# EAGLE design NewBoard (EAGLE 9.6.2)
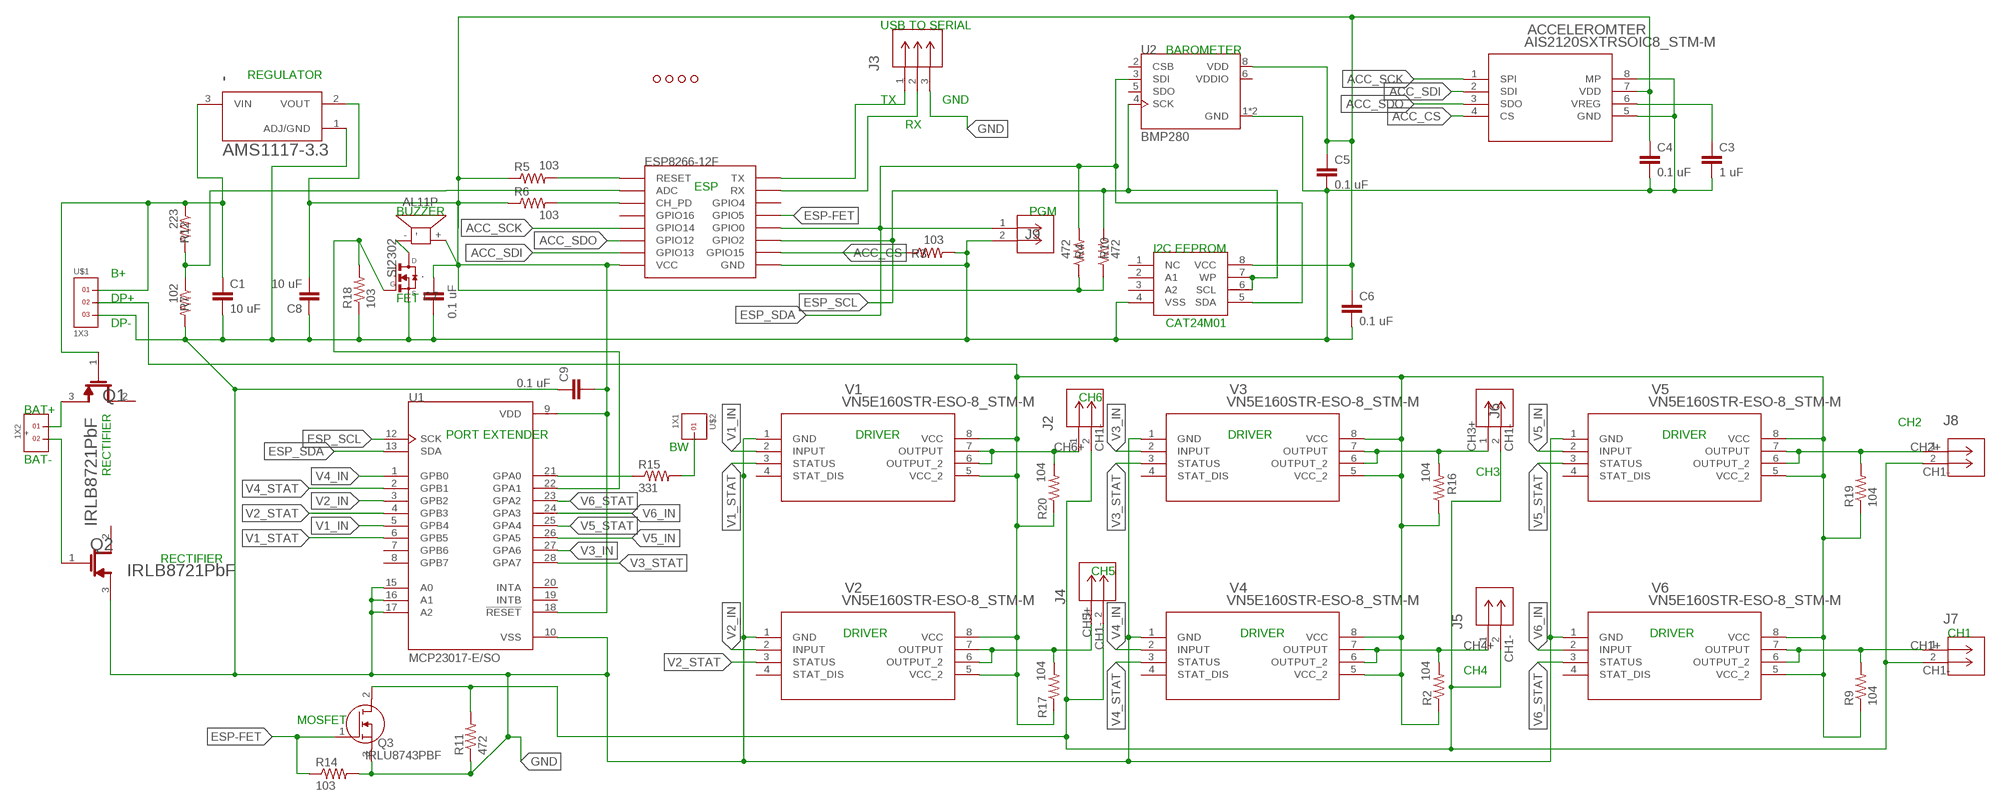
[diagram p0: schematic, sheet 1]

## Parts
'  AMS1117-3.3  [SOT229P700X180-4N]
+  1X2  [1X2]
,  AL11P  [AL11P]
.  SI2302  [SOT23]
ACCELEROMTER  AIS2120SXTRSOIC8_STM-M  [SOIC8_STM-M]
C1  10 uF  C-EUC1206  [C1206]
C3  1 uF  C-EUC1206  [C1206]
C4  0.1 uF  C-EUC1206  [C1206]
C5  0.1 uF  C-EUC1206  [C1206]
C6  0.1 uF  C-EUC1206  [C1206]
C7  0.1 uF  C-EUC1206  [C1206]
C8  10 uF  C-EUC1206  [C1206]
C9  0.1 uF  C-EUC1206  [C1206]
CAT24M01A_EEPROM  CAT24M01WI-GT3  [SO08]
ESP8266-12F  ESP12SMD  [ESP12-SMD]
J2  61300211121  [CONN_61300211121_WRE]
J3  68000-103HLF  [CONN_68000-103HLF_AMP]
J4  61300211121  [CONN_61300211121_WRE]
J5  61300211121  [CONN_61300211121_WRE]
J6  61300211121  [CONN_61300211121_WRE]
J7  61300211121  [CONN_61300211121_WRE]
J8  61300211121  [CONN_61300211121_WRE]
J9  61300211121  [CONN_61300211121_WRE]
Q1  INFINEON_IRLB8721PBFINFINEON_IRLB8721PBF_0_0  [INFINEON_IRLB8721PBF_0]
Q2  INFINEON_IRLB8721PBFINFINEON_IRLB8721PBF_0_0  [INFINEON_IRLB8721PBF_0]
Q3  IRLU8743PBF  [TO229P239X654X978-3P]
R2  104  R-US_R2010  [R2010]
R3  103  R-US_R2010  [R2010]
R4  472  R-US_R2010  [R2010]
R5  103  R-US_R2010  [R2010]
R6  103  R-US_R2010  [R2010]
R7  102  R-US_R2010  [R2010]
R9  104  R-US_R2010  [R2010]
R10  472  R-US_R2010  [R2010]
R11  472  R-US_R2010  [R2010]
R12  223  R-US_R2010  [R2010]
R14  103  R-US_R2010  [R2010]
R15  331  R-US_R2010  [R2010]
R16  104  R-US_R2010  [R2010]
R17  104  R-US_R2010  [R2010]
R18  103  R-US_R2010  [R2010]
R19  104  R-US_R2010  [R2010]
R20  104  R-US_R2010  [R2010]
U1  MCP23017-E/SO  [SOIC127P1030X265-28N]
U2  BMP280  [XDCR_BMP280]
U$1  1X3  [1X3]
U$2  1X1  [1X1]
U$3  HOLE.4MM  [#4]
U$4  HOLE.4MM  [#4]
U$5  HOLE.4MM  [#4]
U$6  HOLE.4MM  [#4]
V1  VN5E160STR-ESO-8_STM-M  [SO-8_STM-M]
V2  VN5E160STR-ESO-8_STM-M  [SO-8_STM-M]
V3  VN5E160STR-ESO-8_STM-M  [SO-8_STM-M]
V4  VN5E160STR-ESO-8_STM-M  [SO-8_STM-M]
V5  VN5E160STR-ESO-8_STM-M  [SO-8_STM-M]
V6  VN5E160STR-ESO-8_STM-M  [SO-8_STM-M]

## Nets
ACC_CS: ACCELEROMTER.4(CS) ESP8266-12F.GPIO15 R3.1
ACC_SCK: ACCELEROMTER.1(SPI) ESP8266-12F.GPIO14
ACC_SDI: ACCELEROMTER.2(SDI) ESP8266-12F.GPIO13
ACC_SDO: ACCELEROMTER.3(SDO) ESP8266-12F.GPIO12
B+: '.3(VIN) C1.1 Q1.1(G) R12.1 U$1.1
CH1+: J7.1 R9.2 V6.6(OUTPUT_2) V6.7(OUTPUT)
CH1-: J2.2 J4.2 J5.2 J6.2 J7.2 J8.2 Q3.2(D) R11.2
CH2+: J8.1 R19.2 V5.6(OUTPUT_2) V5.7(OUTPUT)
CH3+: J6.1 R16.2 V3.6(OUTPUT_2) V3.7(OUTPUT)
CH4+: J5.1 R2.2 V4.6(OUTPUT_2) V4.7(OUTPUT)
CH5+: J4.1 R17.2 V2.6(OUTPUT_2) V2.7(OUTPUT)
CH6+: J2.1 R20.2 V1.6(OUTPUT_2) V1.7(OUTPUT)
DP+: R2.1 R9.1 R16.1 R17.1 R19.1 R20.1 U$1.2 V1.5(VCC_2) V1.8(VCC) V2.5(VCC_2) V2.8(VCC) V3.5(VCC_2) V3.8(VCC) V4.5(VCC_2) V4.8(VCC) V5.5(VCC_2) V5.8(VCC) V6.5(VCC_2) V6.8(VCC)
ESP-FET: ESP8266-12F.GPIO5 Q3.1(G) R14.1
ESP_SCL: CAT24M01A_EEPROM.6(SCL) CAT24M01A_EEPROM.7(WP) ESP8266-12F.GPIO2 R10.2 U1.12(SCK) U2.4(SCK)
ESP_SDA: CAT24M01A_EEPROM.5(SDA) ESP8266-12F.GPIO0 J9.1 R4.2 U1.13(SDA) U2.3(SDI)
GND: '.1(ADJ/GND) ..2(S) ACCELEROMTER.5(GND) ACCELEROMTER.8(MP) C1.2 C3.2 C4.2 C5.2 C6.2 C7.1 C8.1 C9.1 CAT24M01A_EEPROM.4(VSS) ESP8266-12F.GND J3.3 J9.2 Q2.3(S) Q3.3(S) R3.2 R7.2 R11.1 R14.2 R18.1 U1.10(VSS) U1.15(A0) U1.16(A1) U1.17(A2) U2.1(GND) U2.7(GND) U$1.3 V1.1(GND) V2.1(GND) V3.1(GND) V4.1(GND) V5.1(GND) V6.1(GND)
N$1: ESP8266-12F.CH_PD R6.2
N$2: ESP8266-12F.RESET R5.2
N$3: +.2 Q2.1(G)
N$4: ACCELEROMTER.6(VREG) C3.1
N$5: ESP8266-12F.TXD0(TX) J3.1
N$6: ESP8266-12F.RXD0(RX) J3.2
N$7: ,.- ..3(D)
N$8: +.1 Q1.3(S)
N$9: '.2(VOUT) ,.+ ACCELEROMTER.7(VDD) C4.1 C5.1 C6.1 C7.2 C8.2 C9.2 CAT24M01A_EEPROM.8(VCC) ESP8266-12F.VCC R4.1 R5.1 R6.1 R10.1 U1.9(VDD) U1.18(!RESET) U2.8(VDD)
N$10: R15.2 U$2.1
N$16: ESP8266-12F.ADC R7.1 R12.2
N$21: R15.1 U1.21(GPA0)
N$25: ..1(G) R18.2 U1.22(GPA1)
V1_IN: U1.5(GPB4) V1.2(INPUT)
V1_STAT: U1.6(GPB5) V1.3(STATUS)
V2_IN: U1.3(GPB2) V2.2(INPUT)
V2_STAT: U1.4(GPB3) V2.3(STATUS)
V3_IN: U1.27(GPA6) V3.2(INPUT)
V3_STAT: U1.28(GPA7) V3.3(STATUS)
V4_IN: U1.1(GPB0) V4.2(INPUT)
V4_STAT: U1.2(GPB1) V4.3(STATUS)
V5_IN: U1.26(GPA5) V5.2(INPUT)
V5_STAT: U1.25(GPA4) V5.3(STATUS)
V6_IN: U1.24(GPA3) V6.2(INPUT)
V6_STAT: U1.23(GPA2) V6.3(STATUS)
Unconnected: CAT24M01A_EEPROM.1(NC) CAT24M01A_EEPROM.2(A1) CAT24M01A_EEPROM.3(A2) ESP8266-12F.GPIO4 ESP8266-12F.GPIO16 Q1.2(D) Q2.2(D) U1.7(GPB6) U1.8(GPB7) U1.19(INTB) U1.20(INTA) U2.2(CSB) U2.5(SDO) V1.4(STAT_DIS) V2.4(STAT_DIS) V3.4(STAT_DIS) V4.4(STAT_DIS) V5.4(STAT_DIS) V6.4(STAT_DIS)

## Notes on the sheet
- USB TO SERIAL
- BAROMETER
- REGULATOR
- TX | GND
- RX
- ESP
- BUZZER | PGM
- I2C EEPROM
- B+
- DP+ | FET
- DP- | CAT24M01
- CH6
- BAT+
- CH2
- PORT EXTENDER | DRIVER | DRIVER | DRIVER
- BW
- BAT-
- RECTIFIER | CH3
- RECTIFIER
- CH5
- DRIVER | DRIVER | DRIVER | CH1
- CH4
- MOSFET

## Power pins joined to a net without a drawn wire
VDDIO: U2.6(VDDIO)

## Library data of the parts
' = AMS1117-3.3:AMS1117-3.3: Sot223/Pkg 1-Amp 3.3-Volt Low Drop Out Voltage Regulatator Check availability <https://pricing.snapeda.com/parts/AMS1117-3.3/Advanced%20Monolithic%20Systems/view-part?ref=eda>; AVAILABILITY: Not in stock; DESCRIPTION: LDO Voltage Regulators 800MA LDO LINEAR REG; MF: Advanced Monolithic Systems; MP: AMS1117-3.3; PACKAGE: SOT-223 Seeed Technology; PRICE: None
+ = headers(2mm):1X2
, = buzzer:AL11P: SPEAKER Source: Buerklin; OC_FARNELL: unknown; OC_NEWARK: unknown
. = SI2302 FET:SI2302: MOSFET N-Channel 20 V (D-S) Check availability <https://pricing.snapeda.com/parts/SI2302/Vishay%20Siliconix/view-part?ref=eda>; AVAILABILITY: Not in stock; DESCRIPTION: N-Channel 20 V 2.6A (Ta) 710mW (Ta) Surface Mount SOT-23-3 (TO-236); MF: Vishay Siliconix; MP: SI2302; PACKAGE: SOT-23-3 Vishay Siliconix; PRICE: None
ACCELEROMTER = AIS2120SXTR:AIS2120SXTR; COPYRIGHT: Copyright (C) 2022 Ultra Librarian. All rights reserved.; DIGI-KEY_PART_NUMBER_1: 497-17055-2-ND; DIGI-KEY_PART_NUMBER_2: 497-17055-1-ND; DIGI-KEY_PART_NUMBER_3: 497-17055-6-ND; MANUFACTURER_PART_NUMBER: AIS2120SXTR; MFR_NAME: STMicroelectronics
C1 C3-C9 = rcl:C-EU: CAPACITOR, European symbol; SPICEPREFIX: C
CAT24M01A_EEPROM = CAT24M01WI-GT3:CAT24M01WI-GT3: Check availability <https://pricing.snapeda.com/parts/CAT24M01WI-GT3/onsemi/view-part?ref=eda>; AVAILABILITY: In Stock; MF: onsemi; MP: CAT24M01WI-GT3; PACKAGE: None; PRICE: None; PURCHASE-URL: https://pricing.snapeda.com/search/part/CAT24M01WI-GT3/?ref=eda
ESP8266-12F = esp8266modules:ESP12: ESP8266 Wifi module 12
J2 J4-J9 = 2pin-header:61300211121; COPYRIGHT: Copyright (C) 2022 Ultra Librarian. All rights reserved.; DIGI-KEY_PART_NUMBER_1: 732-5315-ND; DIGI-KEY_PART_NUMBER_2: 732-5315-NDL; MANUFACTURER_PART_NUMBER: 61300211121; MFR_NAME: Wurth Electronics
J3 = 3pin-header:68000-103HLF; COPYRIGHT: Copyright (C) 2022 Ultra Librarian. All rights reserved.; DIGI-KEY_PART_NUMBER_1: 609-3461-ND; DIGI-KEY_PART_NUMBER_2: 609-3461-NDL; MANUFACTURER_PART_NUMBER: 68000-103HLF; MFR_NAME: Amphenol ICC
Q1 Q2 = Infineon - IRLB8721PbF:INFINEON_IRLB8721PBF: High Frequency Synchronous Buck Converter; CENTROID_NOT_SPECIFIED: No; DATASHEET: https://upverter.com/datasheet/6023de1dc29e00ae136963535d37ebb95ee78d8c.pdf; DIGIKEY_DESCRIPTION: TRANS MOSFET N-CH 30V 62A TO-220AB; DIGIKEY_PART_NUMBER: IRLB8721PBF-ND; IMPORTED_FROM: octopart; IPC_LAND_PATTERN_NAME: TO-220; LEAD_FREE: yes; MF: Infineon; MOUNTING_TYPE: through hole; MOUSER_PART_NUMBER: 942-IRLB8721PBF; MPN: IRLB8721PbF; NUM_PINS: 3; PACKAGE: TO220AB-3; PREFIX: Q; ROHS: yes; SYMBOL_0_0: N-Channel Enhanced MOSFET; TEMPERATURE_RANGE_HIGH: +175°C; TEMPERATURE_RANGE_LOW: -55°C; TYPE: transistor
Q3 = IRLU8743PbF MOSFET:IRLU8743PBF: International Rectifier IRLU8743PBF N-channel MOSFET Transistor, 160 A, 30 V, 3-Pin IPAK Source: Datasheet <https://www.infineon.com/dgdl/irlr8743pbf.pdf?fileId=5546d462533600a4015356719c7e26ff>; DESCRIPTION: International Rectifier IRLU8743PBF N-channel MOSFET Transistor, 160 A, 30 V, 3-Pin IPAK; HEIGHT: 2.39mm; MANUFACTURER_NAME: Infineon; MANUFACTURER_PART_NUMBER: IRLU8743PBF; MOUSER_PART_NUMBER: 942-IRLU8743PBF; MOUSER_PRICE-STOCK: https://www.mouser.co.uk/ProductDetail/Infineon-IR/IRLU8743PBF?qs=9%252BKlkBgLFf0JLEgW4VJLPg%3D%3D
R2-R7 R9-R12 R14-R20 = rcl:R-US_: RESISTOR, American symbol; SPICEPREFIX: R
U1 = MCP23017-E_SO:MCP23017-E/SO: MCP23017 Series 5.5 V 1.7 MHz SMT 16-Bit I2C I/O Expander - SOIC-28 Check availability <https://pricing.snapeda.com/parts/MCP23017-E/SO/Microchip/view-part?ref=eda>; AVAILABILITY: In Stock; DESCRIPTION: I/O Expander 16 I²C 1.7 MHz 28-SOIC; MF: Microchip; MP: MCP23017-E/SO; PACKAGE: SOIC-28 Microchip; PRICE: None; PURCHASE-URL: https://pricing.snapeda.com/search/part/MCP23017-E/SO/?ref=eda
U2 = BMP280:BMP280: BMP280 Absolute Barometric Pressure Sensor for Battery Powered Devices 2 x 2.5mm Check availability <https://pricing.snapeda.com/parts/BMP280/Bosch/view-part?ref=eda>; AVAILABILITY: In Stock; DESCRIPTION: Pressure Sensor 4.35PSI ~ 15.95PSI (30kPa ~ 110kPa) Absolute - 16b 8-SMD; MF: Bosch; MP: BMP280; PACKAGE: SMD-8 Bosch Sensortec; PRICE: None; PURCHASE-URL: https://pricing.snapeda.com/search/part/BMP280/?ref=eda
U$1 = headers(2mm):1X3
U$2 = headers(2mm):1X1
U$3-U$6 = screw_holes:HOLE
V1-V6 = VN5E160STR-E:VN5E160STR-E; COPYRIGHT: Copyright (C) 2022 Ultra Librarian. All rights reserved.; MANUFACTURER_PART_NUMBER: VN5E160STR-E; MFR_NAME: STMicroelectronics

## Board
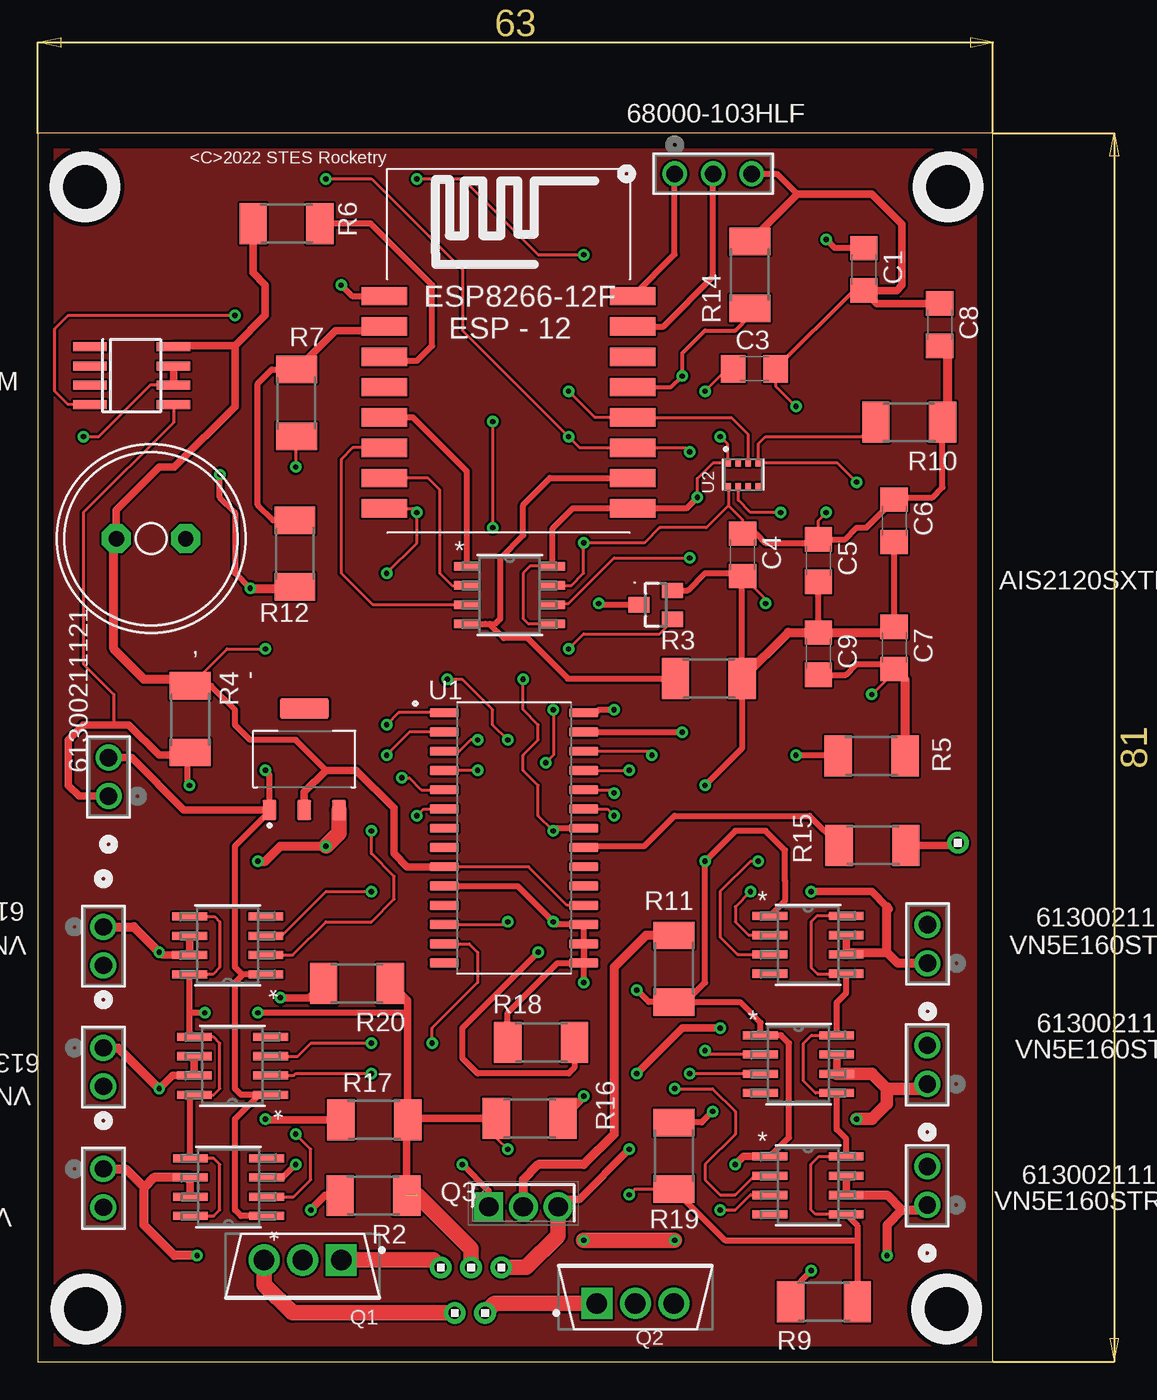
[diagram p1: board, top side]
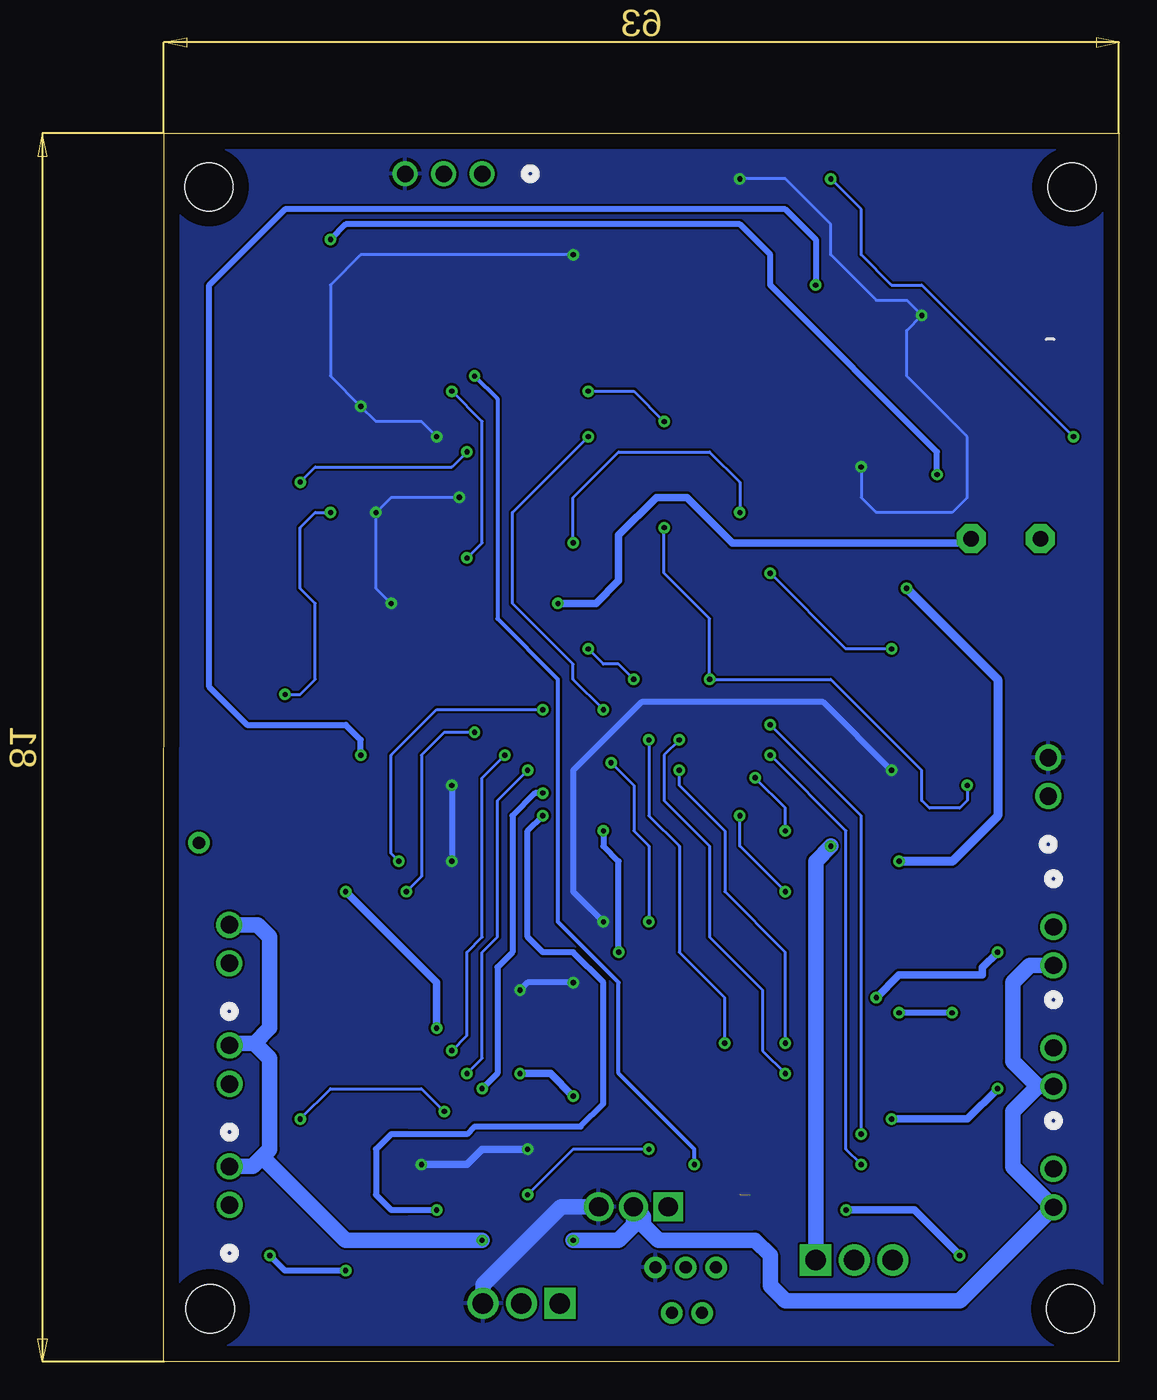
[diagram p2: board, bottom side, seen from below]

Size 63 x 81 mm. Coordinates in mm from the lower left corner, seen from the top.
Outline: 0,0 63,0 62.98,81 0,81 0,0
Copper layers (1*16): Top 0.035mm / dielectric 1.5mm / Bottom 0.035mm
Design rules "default": minimum track width 6mil, minimum drill 0.35mm, track to track 6mil, track to pad 6mil, pad to pad 6mil, via to via 6mil, smd to smd 6mil, copper to edge 40mil, drill to drill 6mil, minimum pad ring 10mil, minimum via ring 8mil, stop-mask expansion 4mil, vias tented up to drill 0mil, thermal gap 10mil

### Footprints (pad centres in the part's own frame; a part is rotated, then mirrored left to right if it is on the bottom)
SOT229P700X180-4N = smd 0.93 x 1.31: 1 -2.29,-3.345; 2 0,-3.345; 3 2.29,-3.345 | smd 3.24 x 1.31: 4 0,3.345
1X2 = drill 0.8 pad 1.422: 1 -1,0; 2 1,0
AL11P = drill 1.016 pad 1.905 octagon: + 2.286,0; - -2.286,0
SOT23 = smd 1 x 1.4: 1 -0.95,-1.1; 2 0.95,-1.1; 3 0,1.1
SOIC8_STM-M = smd 1.664 x 0.559: 1 -2.826,1.905; 2 -2.826,0.635; 3 -2.826,-0.635; 4 -2.826,-1.905; 5 2.826,-1.905; 6 2.826,-0.635; 7 2.826,0.635; 8 2.826,1.905
C1206 = smd 1.6 x 1.8: 1 -1.4,0; 2 1.4,0
SO08 = smd 0.6 x 2.2: 1 -1.905,-2.75; 2 -0.635,-2.75; 3 0.635,-2.75; 4 1.905,-2.75; 5 1.905,2.75; 6 0.635,2.75; 7 -0.635,2.75; 8 -1.905,2.75
ESP12-SMD = smd 3 x 1.2: ADC -8.3,3.8; CH_PD -8.3,1.8; GND 8.1,-8.2; GPIO0 8.1,-2.2; GPIO2 8.1,-4.2; GPIO4 8.1,1.8; GPIO5 8.1,-0.2; GPIO12 -8.3,-4.2; GPIO13 -8.3,-6.2; GPIO14 -8.3,-2.2; GPIO15 8.1,-6.2; GPIO16 -8.3,-0.2; RESET -8.3,5.8; RXD0 8.1,3.8; TXD0 8.1,5.8; VCC -8.3,-8.2
CONN_61300211121_WRE = drill 1.143 pad 1.651: 1 0,0; 2 2.54,0
CONN_68000-103HLF_AMP = drill 1.092 pad 1.6: 1 0,0; 2 2.54,0; 3 5.08,0
INFINEON_IRLB8721PBF_0 = drill 1.35 pad 2.05 square: 1 -0.378,2.54 | drill 1.35 pad 2.05: 2 -0.378,0; 3 -0.378,-2.54
TO229P239X654X978-3P = drill 1.28 pad 1.92 square: 1 0,0 | drill 1.28 pad 1.92: 2 2.29,0; 3 4.58,0
R2010 = smd 1.8 x 2.7: 1 -2.2,0; 2 2.2,0
SOIC127P1030X265-28N = smd 1.9 x 0.6: 1 -4.605,8.255; 2 -4.605,6.985; 3 -4.605,5.715; 4 -4.605,4.445; 5 -4.605,3.175; 6 -4.605,1.905; 7 -4.605,0.635; 8 -4.605,-0.635; 9 -4.605,-1.905; 10 -4.605,-3.175; 11 -4.605,-4.445; 12 -4.605,-5.715; 13 -4.605,-6.985; 14 -4.605,-8.255; 15 4.605,-8.255; 16 4.605,-6.985; 17 4.605,-5.715; 18 4.605,-4.445; 19 4.605,-3.175; 20 4.605,-1.905; 21 4.605,-0.635; 22 4.605,0.635; 23 4.605,1.905; 24 4.605,3.175; 25 4.605,4.445; 26 4.605,5.715; 27 4.605,6.985; 28 4.605,8.255
XDCR_BMP280 = smd 0.5 x 0.35: 1 0.8,0.975; 2 0.8,0.325; 3 0.8,-0.325; 4 0.8,-0.975; 5 -0.8,-0.975; 6 -0.8,-0.325; 7 -0.8,0.325; 8 -0.8,0.975
1X3 = drill 0.8 pad 1.422: 1 -2,0; 2 0,0; 3 2,0
1X1 = drill 0.8 pad 1.422: 1 0,0
#4 = hole 3.175: 0,0
SO-8_STM-M = smd 2.286 x 0.533: 1 -2.515,1.905; 2 -2.515,0.635; 3 -2.515,-0.635; 4 -2.515,-1.905; 5 2.515,-1.905; 6 2.515,-0.635; 7 2.515,0.635; 8 2.515,1.905

### Placement (x,y rotation side)
'  17.57,39.73 0 top
+  28.49,3.21 0 top
,  7.46,54.27 180 top
.  40.75,49.91 90 top
ACCELEROMTER  31.12,50.55 0 top
C1  54.48,72.04 270 top
C3  47.26,65.48 0 top
C4  46.48,53.21 270 top
C5  51.48,52.83 270 top
C6  56.48,55.45 270 top
C7  56.48,47.07 270 top
C8  59.48,68.39 270 top
C9  51.48,46.69 270 top
CAT24M01A_EEPROM  6.19,65.03 270 top
ESP8266-12F  31.14,64.47 0 top
J2  4.32,28.67 270 top
J3  42,78.34 0 top
J4  4.32,20.69 270 top
J5  4.32,12.71 270 top
J6  58.68,26.27 90 top
J7  58.66,10.33 90 top
J8  58.66,18.31 90 top
J9  4.66,37.29 90 top
Q1  17.46,6.32 270 top
Q2  39.41,4.22 90 top
Q3  29.73,10.21 0 top
R2  22.13,10.95 180 top
R3  44.25,45.05 0 top
R4  10.05,42.37 270 top
R5  54.99,39.95 180 top
R6  16.39,75.05 0 top
R7  17.05,63.23 270 top
R9  51.85,3.95 180 top
R10  57.47,61.95 180 top
R11  41.95,25.91 90 top
R12  16.95,53.29 90 top
R14  46.95,71.67 90 top
R15  55.05,34.05 0 top
R16  32.43,16.05 0 top
R17  22.19,15.95 180 top
R18  33.19,21.05 0 top
R19  41.95,13.57 90 top
R20  21.05,24.95 180 top
U1  31.4,34.54 0 top
U2  46.52,58.49 90 top
U$1  28.57,6.21 0 top
U$2  60.68,34.21 0 top
U$3  3.18,3.48 0 top
U$4  3.1,77.48 0 top
U$5  60.02,77.48 0 top
U$6  59.94,3.48 0 top
V1  12.52,27.45 180 top
V2  12.83,19.51 180 top
V3  50.8,27.49 0 top
V4  12.57,11.51 180 top
V5  50.17,19.62 0 top
V6  50.8,11.62 0 top

### Tracks (layer width: path | path; a pad name or v marks a point on that pad's centre or on a via)
3.3V
  pour Top: 0,81 63,81 63,0 0,0
ACC_CS
  Top 0.2: ESP8266-12F.GPIO15 38.97,58
  Top 0.406: ACCELEROMTER.4 29.5,48.65 29.79,48.65 | 29.79,48.65 30.73,47.71 32.29,47.71 34.95,45.05 R3.1 | 29.79,48.65 30.14,48.65 30.5,49 30.5,53 32,54.5 32,56.5 33.77,58.27 ESP8266-12F.GPIO15
ACC_SCK
  Top 0.406: ACCELEROMTER.1 28.29,58.71 24.73,62.27 ESP8266-12F.GPIO14
ACC_SDI
  Top 0.2: ESP8266-12F.GPIO13 25.73,58.27 26.5,57.5 26.5,52 27.32,51.19 ACCELEROMTER.2
ACC_SDO
  Top 0.2: ESP8266-12F.GPIO12 20.77,60.27 20,59.5 20,52 22.09,49.91 ACCELEROMTER.3
B+  (via drill 0.35)
  Top 0.4: v14,51 13,52 13,56 12,57 v12,58.5 | C1.1 52.56,73.44 v52,74
  Top 0.61: v14.5,33 15,33 16,34 v19,34 | v14,51 17,51 17,51.04 R12.1
  Top 1.016: U$1.1 26.08,6.7 Q1.1 | '.3 19.86,34.86 v19,34
  Bottom 0.4: v12,58.5 12,60 23,71 23,73 25,75 51,75 v52,74
  Bottom 0.61: v14.5,33 11,33 8,36 8,45 v14,51
  Bottom 1.016: Q1.1 20,33 v19,34
CH1+  (via drill 0.35)
  Top 0.406: R9.2 49.65,4.65 v51,6
  Top 0.508: V6.7 V6.6 53.33,11
  Top 0.61: V6.6 56.02,10.98 57,10 | 57,10 58.33,10 J7.1 | 57,10 56,9 v56,7
  Bottom 0.406: v51,6 55,6 v56,7
CH1-  (via drill 0.35)
  Top 0.61: R11.2 40.11,28.11 38,26 38,15 36,13 33,13 32,12 32,10.23 Q3.2
  Top 1.016: v36,8 v42,8
  Bottom 1.016: J7.2 57.13,12.87 56.5,13.5 | 56.5,13.5 56,14 56,20 57,21 | 57,21 58.51,21 J8.2 | v36,8 33,8 32.02,8.98 Q3.2 31.35,9.54 31.35,8.98 30.37,8 24,8 23,7 23,5 22,4 10.49,4 J5.2 7,12.85 7,16.5 5.35,18.15 | v42,8 51,8 56.5,13.5 | J6.2 56.81,28.81 56,28 56,22 57,21 | 5.35,18.15 J4.2 | J2.2 5.87,26.13 7,25 7,19.8 5.35,18.15
CH2+  (via drill 0.35)
  Top 0.406: v44.5,16.5 43.77,15.77 R19.2
  Top 0.508: V5.6 V5.7
  Top 0.813: V5.6 55.02,18.98 56,18 | 56,18 58.35,18 J8.1 | v54,16 55,16 56,17 56,18
  Bottom 0.2: v44.5,16.5 46,18 52,18 v54,16
CH3+  (via drill 0.35)
  Top 0.508: V3.6 V3.7 | R16.2 36,17.42 v36,17.5 | v39.5,19 42.5,22 v45,22 | v51,31 55,31 56,30 56.15,29.86
  Top 0.61: J6.1 56.73,26.27 56,27 | 56,27 56,30 | V3.6 53.46,27 56,27
  Bottom 0.508: v36,17.5 37.5,19 v39.5,19 | v45,22 45,25 v51,31
CH4+  (via drill 0.35)
  Top 0.508: V4.7 V4.6 9.91,12 | v18,10 18.95,10.95 R2.2
  Top 0.61: J5.1 5.79,12.71 7,11.5 | v10.5,7 9,7 7,9 7,11.5 | V4.6 7.64,12.14 7,11.5
  Bottom 0.508: v18,10 13.5,10 v10.5,7
CH5+  (via drill 0.35)
  Top 0.508: 10.17,20 V2.6 V2.7 8.88,18.88 v8,18 | R17.2 14.95,15.95 v15,16
  Top 0.61: J4.1 5.31,20.69 v8,18
  Bottom 0.508: v8,18 10,16 v15,16
CH6+  (via drill 0.35)
  Top 0.508: 9.92,28 V1.6 V1.7 8.19,26.82 v8,27 | R20.2 17.9,24 v16,24
  Top 0.61: J2.1 6.33,28.67 v8,27
  Bottom 0.508: v8,27 9,26 9,25.5 14.5,25.5 v16,24
DP+  (via drill 0.35)  (1 unrouted)
  Top 0.2: V1.5 11.64,29.36 12,29 12,26 11.54,25.55 V1.8 | V2.8 11.61,17.61 12,18 12,21 11.59,21.41 V2.5 | V4.8 11.61,9.61 12,10 12,13 11.59,13.41 V4.5 | V3.8 51.4,29.39 51,29 51,26 51.41,25.59 V3.5 | V6.5 51.28,9.71 51,10 51,13 51.52,13.53 V6.8 | R16.1 30.23,14.77 v31,14 | R19.1 39.37,11.37 v39,11 | V5.5 51.28,17.71 50.5,18.5 50.5,21 51.02,21.52 V5.8
  Top 0.406: V6.5 54.05,8.98 54.05,8 | 54.05,8 R9.1 | R19.1 45.32,8 54.05,8 | V2.5 10.01,21.73 10.01,23 | 10.01,23 V1.8 | V4.5 10.05,17.34 V2.8 | V6.8 53.31,14.69 52.69,15.31 V5.5 | V5.8 52.69,23.68 53.31,24.32 V3.5 | v11,23 10.01,23 | 24.39,23 v14.5,23
  Top 0.508: R2.1 24.33,15.89 R17.1 | R17.1 24.39,23 24.39,23.81 R20.1 | R17.1 24.49,16.05 R16.1
  Top 1.016: U$1.2 28.57,7.43 25,11
  Bottom 0.2: v31,14 36,14 v39,11
  Bottom 0.406: v11,23 v14.5,23
ESP-FET  (via drill 0.35)
  Top 0.254: ESP8266-12F.GPIO5 41.77,64.27 v42.5,65 42.5,66.5 44,68 46,68 47,69 47,69.42 R14.1
  Top 0.406: Q3.1 29.73,11.27 v28,13
  Bottom 0.254: v28,13 28,14 33,19 33,25 37,29 37,45 41,49 41,63.5 v42.5,65
ESP_SCL  (via drill 0.35)
  Top 0.2: R10.2 54.32,61 48,61 47.49,60.49 U2.4 52.71,59.29 v54,58 | U1.12 30.82,28.82 v31,29 | v34,43 34,40 v33.5,39.5 | CAT24M01A_EEPROM.6 7.39,64.39 4,61 v3,61 | v19,78 22,78 28,72 28,68 v35,61 35.73,60.27 ESP8266-12F.GPIO2 42.73,60.27 v43,60
  Top 0.508: CAT24M01A_EEPROM.6 CAT24M01A_EEPROM.7
  Bottom 0.2: v33.5,39.5 32,38 32,35 31,34 v31,29 | v34,43 36,45 36,46 40,50 40,56 v35,61 | v19,78 17,76 17,73 15,71 13,71 v3,61 | v43,60 44,59 53,59 v54,58
ESP_SDA  (via drill 0.35)
  Top 0.2: U2.3 46.84,61.16 45.73,62.27 ESP8266-12F.GPIO0 36.73,62.27 v35,64 | v31,41 30,42 30,43 28,45 v27,45 | U1.13 28.45,27.55 29,27 29,25 26,22 v26,21 | CAT24M01A_EEPROM.5 8.94,61.94 3,56 3,46 5,44 5,42 | v30,62 v30,55
  Top 0.4: v10,38 9.88,38.12 9.88,40
  Top 0.508: J9.1 2.71,37.29 2,38 2,41 3,42 5,42 6,42 8,40 9.88,40 R4.2
  Bottom 0.2: v26,21 26,24 29,27 29,34 31,36 v31,41 | v30,55 30,52 27,49 v27,45 19,45 13,39 13,37 12.5,36.5 10.5,36.5 10,37 v10,38 | v35,64 32,64 v30,62
GND  (via drill 0.35)
  Top 0.2: ACCELEROMTER.5 32.35,48.65 32,49 32,52 32.45,52.45 ACCELEROMTER.8 | v43.5,57 43.5,58.24 44.55,59.29 U2.1 45.5,59.34 45.5,60.5 v45,61 | v49,56 47,56 46.2,56.8 U2.7 | v50,63 48.66,64.34 C3.2 | CAT24M01A_EEPROM.4 1.99,63.12 1.12,64 1.12,68.12 2,69 v13,69 | v25,78 28,78 33,73 v36,73 | R7.2 17,60.98 v17,59 | C4.2 48,50.29 v48,50
  Top 0.254: C3.2 53.82,70.64 C1.2
  Top 0.4: V6.1 49.55,14.79 49.55,21 49.02,21.52 V5.1 | v36,25 U1.15 U1.16 | R11.1 40.29,23.71 v39.5,24.5 | v43.5,57 42.77,56.27 ESP8266-12F.GND 35.27,56.27 33.95,54.95 ACCELEROMTER.8 | 49.28,31.71 49.28,30.39 V3.1 | 42,23.71 42.71,23.71 44,25 v44,33 | R3.2 46.45,40.45 v44,38 | '.1 15.28,38.72 v15,39
  Top 0.406: R18.1 30.99,22.99 34.28,26.29 U1.15 U1.17 34.17,28.82 v34,29 31.64,31.36 U1.10 | R11.1 42,23.71 46.29,23.71 47.66,22.34 V5.1 | V1.1 13.54,25.55 | 13.54,25.55 13.46,25.55 13,26 13,34 15.28,36.28 '.1 | R3.2 46.45,51.78 | 46.45,51.78 C4.2 | V4.1 13.39,9.61 13,10 13,16 14.61,17.61 V2.1 13.39,17.61 13,18 13,25 13.54,25.55 | ..2 42.86,50.86 44,52 46.23,52 46.45,51.78 | C7.1 C6.2 | C9.1 C5.2 | 49.28,31.71 49.28,33.72 48,35 46,35 v44,33 | J3.3 48.74,78.34 50.08,77
  Top 0.508: J9.2 6.17,39.83 9.62,36.38 '.1 | C8.1 55.33,69.79 C1.2 56.64,70.64 57,71 57,75 55,77 50.08,77 R14.2 | v46,13 46.52,13.53 V6.1 | Q3.3 34.81,10.71 35.71,10.71 v39,14
  Top 0.61: R3.2 49.49,48.09 C9.1 56.1,48.09 C7.1
  Top 1.016: U$1.3 32.21,6.21 34.31,8.31 Q3.3
  Bottom 0.2: v45,61 46,62 49,62 v50,63 52,65 52,71 50,73 v36,73 | v25,78 22,78 19,75 19,73 16,70 14,70 v13,69 14,68 14,65 10,61 10,57 11,56 16,56 17,57 v17,59 | v48,50 49,51 v49,56 48,57 v43.5,57
  Bottom 0.4: v36,25 39,25 v39.5,24.5 | v44,38 v44,33 | v15,39 19.5,43.5 31.5,43.5 36,39 36,31 v34,29
  Bottom 0.508: v39,14 42,14 43,13 v46,13
  Bottom 1.016: Q2.3 41.95,5.05 36.79,10.21 Q3.3
  pour Bottom: 0,81 63,81 63,0 0,0
  pour Bottom: 0,81 63,81 63,0 0,0
N$1
  Top 0.4: ESP8266-12F.CH_PD 23.11,66 25,66 26,67 26,71 21.95,75.05 R6.2
N$2  (via drill 0.35)
  Top 0.4: ESP8266-12F.RESET 20.73,70.27 v20,71 | v50,40 52.74,40 R5.2
  Bottom 0.4: v50,40 50,41 51,42 57.5,42 60,44.5 60,71 55,76 22,76 20,74 v20,71
N$3
  Top 1.016: +.2 30.12,3.84 Q2.1
N$4  (via drill 0.35)
  Top 0.2: ACCELEROMTER.6 34.03,50 35,50 38,53 v43,53 | C3.1 45.48,65.48 v44,64
  Bottom 0.2: v43,53 42,54 42,62 v44,64
N$5
  Top 0.406: ESP8266-12F.TXD0 42,73.03 J3.1
N$6
  Top 0.406: ESP8266-12F.RXD0 41.27,68.27 44.54,71.54 J3.2
N$7  (via drill 0.35)
  Top 0.406: ..3 37.09,49.91 v37,50
  Bottom 0.508: ,.- 10.02,54 25.5,54 28.5,57 30.5,57 33,54.5 33,51.5 34.5,50 v37,50
N$8
  Top 1.016: +.1 16.79,3.21 14.92,5.08 Q1.3
N$9  (via drill 0.35)
  Top 0.2: U2.8 45.55,56.45 | C4.1 46.48,55.52 45.55,56.45 | U1.18 34.91,30.09 32.37,32.63 U1.9 | C5.1 51.48,55.48 v52,56 | C7.2 56.48,45.48 v55,44 | ACCELEROMTER.7 35.19,51.19 36,52 v36,54 40,54 41,55 44.09,55 45.55,56.45 | ESP8266-12F.VCC 24.73,56.27 v25,56 25,54 v23,52 | R4.1 12.48,47 v15,47
  Top 0.4: 19,39 17,41 14,41 13,42 13,43 11.43,44.57 R4.1 | C4.1 47.39,54.61 48,54 51.25,54 C5.1 53.23,54.23 54,55 54.63,55 C6.1 | C9.2 53.29,45.29 54,46 56.15,46 C7.2
  Top 0.406: C6.1 56.63,57 59,57 59.67,57.67 R10.1
  Top 0.508: R6.1 14.19,71.81 15,71 15,69 13,67 | CAT24M01A_EEPROM.8 9.01,67 13,67 | ,.+ 5.17,56.17 8,59 9,59 13,63 13,67 | '.2 17.57,37.57 19,39 21,39 23.5,36.5 23.5,33.5 24.36,32.63 U1.9
  Top 0.61: R4.1 9.62,45 7,45 5,47 5,54.1 ,.+ | C8.2 60,66.47 60,62.28 R10.1 | C7.2 57.19,44.96 R5.1
  Bottom 0.2: v55,44 54,44 53,45 53,50 54,51 54,55 53,56 v52,56 | v23,52 18,47 v15,47 | v25,56 25,58 27,60 33,60 36,57 v36,54
N$10
  Top 0.508: R15.2 60.52,34.05 U$2.1
N$16
  Top 0.406: R12.2 15.51,55.49 14.5,56.5 14.5,64.5 15.43,65.43 R7.1
  Top 0.508: R7.1 19.62,68 22.57,68 ESP8266-12F.ADC
N$21
  Top 0.4: 52.7,33.91 R15.1
  Top 0.406: U1.21 36.1,34 40,34 42,36 50.9,36 R15.1
N$25  (via drill 0.35)
  Top 0.2: v34,35 33,36 33,38 32,39 32,40 33,41 33,42 32,43 v32,45 | v35,47 36,48 41,48 41.85,48.85 ..1
  Top 0.4: R18.2 35.39,19.39 35,19 29,19 28,20 28,22 v33,27 | U1.22 34.17,35.17 v34,35
  Bottom 0.2: v32,45 33,46 34,46 v35,47
  Bottom 0.4: v33,27 33,33 34,34 v34,35
V1_IN  (via drill 0.35)
  Top 0.2: V1.2 16.82,26.82 19,29 22,29 23.5,30.5 23.5,32 22,33.5 v22,35 | v24,38.5 24.5,38.5 25.29,37.72 U1.5
  Bottom 0.2: v24,38.5 22,36.5 v22,35
V1_STAT  (via drill 0.35)
  Top 0.2: V1.3 16.09,28.09 19,31 v22,31 | v25,36 25.45,36.45 U1.6
  Bottom 0.2: v22,31 25,34 v25,36
V2_IN  (via drill 0.35)
  Top 0.2: v29,41 28.54,41 27.8,40.26 U1.3 | V2.2 16.88,18.88 17,19 v22,19
  Bottom 0.2: v29,41 30,40 30,37 27,34 27,28 23.5,24.5 23.5,20.5 v22,19
V2_STAT  (via drill 0.35)
  Top 0.2: v29,39 28.98,38.98 U1.4 | V2.3 17.14,20.14 18,21 v22,21
  Bottom 0.2: v29,39 29,38 26,35 26,31 22,27 v22,21
V3_IN  (via drill 0.35)
  Top 0.2: v47,31 46,30 46,29 46.88,28.12 V3.2
  Top 0.406: U1.27 42.48,41.52 v42.5,41.5
  Bottom 0.2: v42.5,41.5 44.5,41.5 46,40 46,32 v47,31
V3_STAT  (via drill 0.35)
  Top 0.2: v47.5,33 47,33 45,31 45,28 46.15,26.86 V3.3
  Top 0.406: U1.28 36.8,42.8 37,43 v38,43
  Bottom 0.2: v47.5,33 48,33.5 48,40 45,43 v38,43
V4_IN  (via drill 0.35)
  Top 0.2: V4.2 16.88,10.88 18,12 18,14 v17,15 | U1.1 23.8,42.8 v23,42
  Bottom 0.2: v17,15 17,36 v23,42
V4_STAT  (via drill 0.35)
  Top 0.2: U1.2 24.52,41.52 v23,40
  Top 0.406: V4.3 16.14,12.14 v17,13
  Bottom 0.2: v17,13 18,14 18,35 v23,40
V5_IN  (via drill 0.35)
  Top 0.2: U1.26 40.24,40.26 v40.5,40 | V5.2 44.24,20.25 v44,20.5
  Bottom 0.2: v44,20.5 43,21.5 43,27 42,28 42,38.5 v40.5,40
V5_STAT  (via drill 0.35)
  Top 0.2: U1.25 38.98,38.98 v39,39 | v43,19 47.64,19 V5.3
  Bottom 0.2: v43,19 42,20 42,27 41,28 41,37 v39,39
V6_IN  (via drill 0.35)
  Top 0.2: U1.24 37.78,37.72 v38,37.5 | V6.2 47.26,12.26 46,11 45,11 44,12 44,13 46,15 46,16.5 44.5,18 v42,18
  Bottom 0.4: v42,18 41,19 41,26 40,27 40,36 38.5,37.5 v38,37.5
V6_STAT  (via drill 0.35)
  Top 0.2: U1.23 37.55,36.45 v38,36 | v45,10 46,10 47,11 48.27,11 V6.3
  Bottom 0.4: 47,10 v45,10 | 47,15 43,15 42.5,15.5 35.5,15.5 34,17 34,25 36,27 38,27 39,28 39,35 v38,36
  Bottom 0.406: 47,15 48,15 49,14 49,11 48,10 47,10

### Text on the board
tPlace: <C>2022 STES Rocketry
200bmp: S:/STES Rocketry/pcb-watermark.bmp